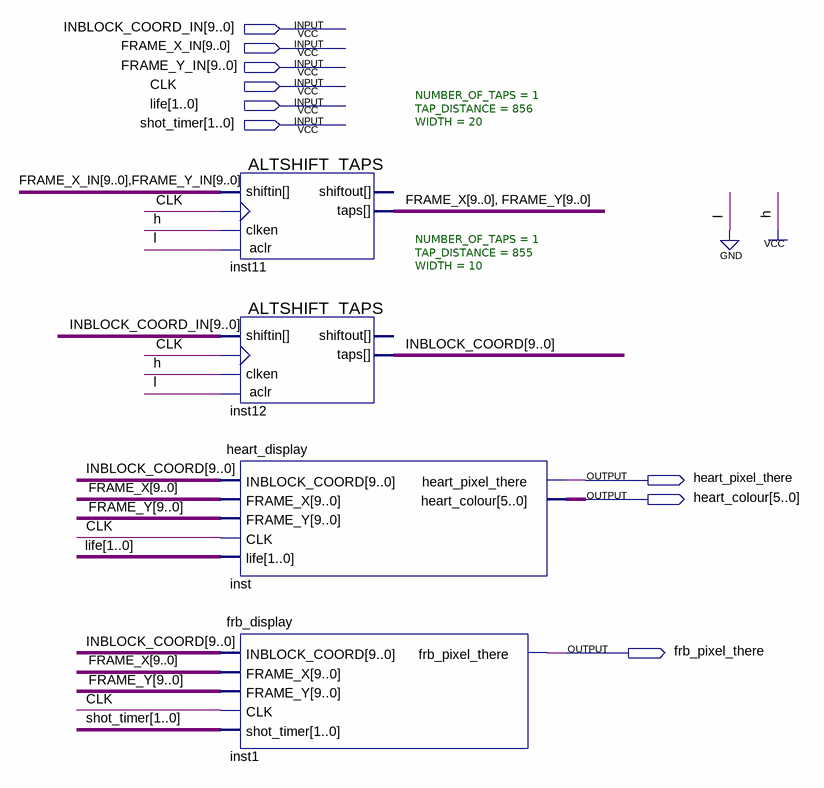
[diagram p0: schematic sheet]
// Quartus schematic HUD_display.bdf as structural Verilog: 4 symbols, 9 pins
module HUD_display (
  input  [9:0] INBLOCK_COORD_IN,
  input  [9:0] FRAME_X_IN,
  input  [9:0] FRAME_Y_IN,
  input  CLK,
  input  [1:0] life,
  input  [1:0] shot_timer,
  output heart_pixel_there,
  output [5:0] heart_colour,
  output frb_pixel_there
);

  wire [9:0] FRAME_X, FRAME_Y, INBLOCK_COORD;

  ALTSHIFT_TAPS #(.NUMBER_OF_TAPS(1), .TAP_DISTANCE(856), .WIDTH(20)) inst11 (
    .shiftin({FRAME_X_IN, FRAME_Y_IN}), .clken(1'b1), .clock(CLK), .aclr(1'b0), .taps({FRAME_X, FRAME_Y}));  // open: shiftout
  ALTSHIFT_TAPS #(.NUMBER_OF_TAPS(1), .TAP_DISTANCE(855), .WIDTH(10)) inst12 (
    .shiftin(INBLOCK_COORD_IN), .clken(1'b1), .clock(CLK), .aclr(1'b0), .taps(INBLOCK_COORD));  // open: shiftout
  heart_display inst (
    .INBLOCK_COORD(INBLOCK_COORD), .FRAME_X(FRAME_X), .FRAME_Y(FRAME_Y), .CLK(CLK), .life(life),
    .heart_pixel_there(heart_pixel_there), .heart_colour(heart_colour));
  frb_display inst1 (
    .INBLOCK_COORD(INBLOCK_COORD), .FRAME_X(FRAME_X), .FRAME_Y(FRAME_Y), .CLK(CLK), .shot_timer(shot_timer),
    .frb_pixel_there(frb_pixel_there));
endmodule
